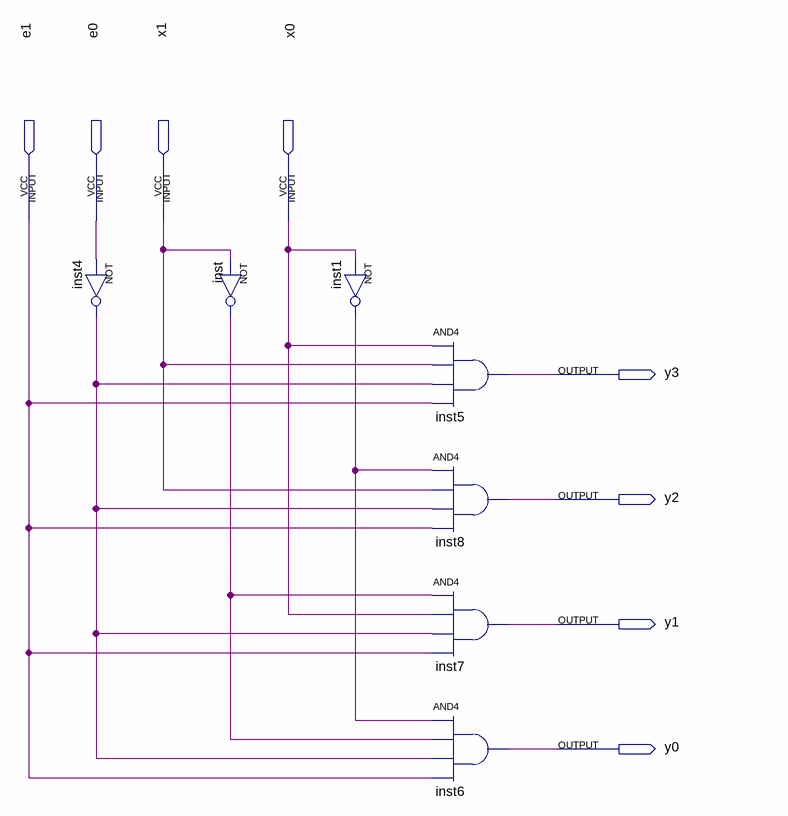
[diagram p0: schematic sheet]
// Quartus schematic DecoderDemo.bdf as structural Verilog: 7 symbols, 8 pins
module DecoderDemo (
  input  e1,
  input  e0,
  input  x1,
  input  x0,
  output y3,
  output y2,
  output y1,
  output y0
);

  wire inst1_out, inst4_out, inst_out;

  not inst4 (inst4_out, e0);
  not inst (inst_out, x1);
  not inst1 (inst1_out, x0);
  and inst5 (y3, x0, x1, inst4_out, e1);
  and inst8 (y2, inst1_out, x1, inst4_out, e1);
  and inst7 (y1, inst_out, x0, inst4_out, e1);
  and inst6 (y0, inst1_out, inst_out, inst4_out, e1);
endmodule
